# Altium schematic sheet ui_sdram.SchDoc: mcHF Pro Transceiver UI board
size A3; Author: Krassi Atanassov; CompanyName: MØNKA; Engineer: For radio amateurs experimentation, non-commercial use only. Thank you!; Revision: 0.8.5; SheetTotal: 13
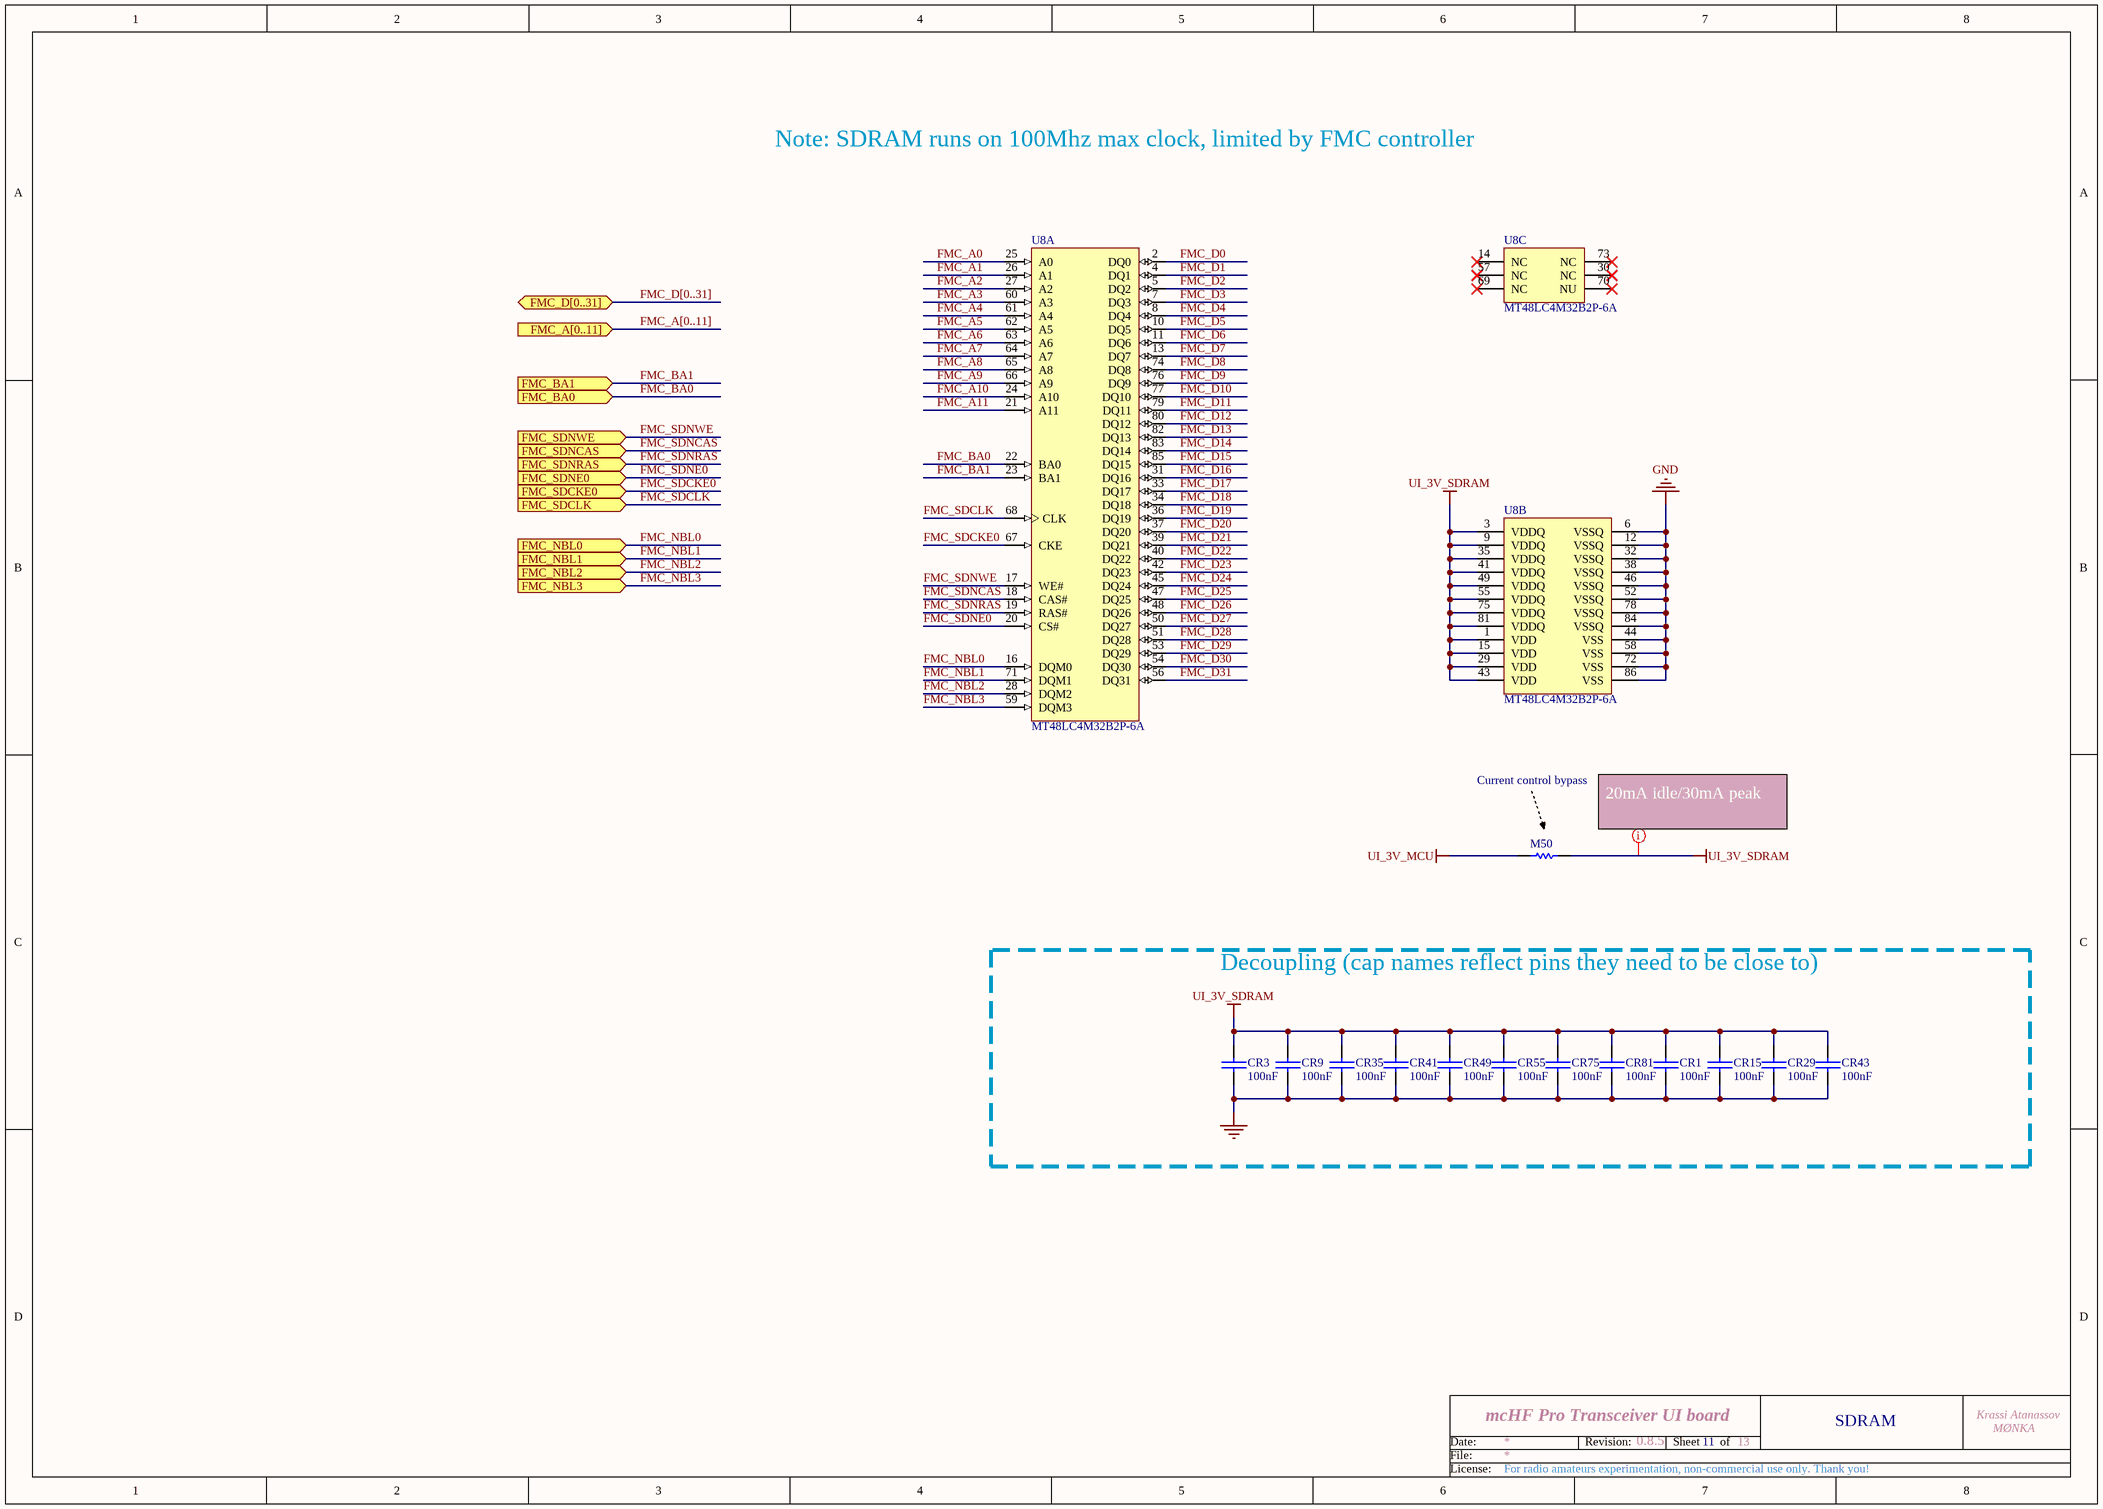
[diagram p0: ui_sdram.SchDoc]

## Parts
CR1  100nF  [0805]
CR3  100nF  [0805]
CR9  100nF  [0805]
CR15  100nF  [0805]
CR29  100nF  [0805]
CR35  100nF  [0805]
CR41  100nF  [0805]
CR43  100nF  [0805]
CR49  100nF  [0805]
CR55  100nF  [0805]
CR75  100nF  [0805]
CR81  100nF  [0805]
M50  0  [SB_0603]  (value not drawn)  (net tie, no BOM)
U8  MT48LC4M32B2P-6A  [MICT-TG-86_N]  (parts A,B,C of 3)

## Blocks framed on the sheet
Decoupling (cap names reflect pins they need to be close to): CR1 CR3 CR9 CR15 CR29 CR35 CR41 CR43 CR49 CR55 CR75 CR81

## Ports
FMC_A[0..11] (in), FMC_BA0 (in), FMC_BA1 (in), FMC_D[0..31] (bidir), FMC_NBL0 (in), FMC_NBL1 (in), FMC_NBL2 (in), FMC_NBL3 (in), FMC_SDCKE0 (in), FMC_SDCLK (in), FMC_SDNCAS (in), FMC_SDNE0 (in), FMC_SDNRAS (in), FMC_SDNWE (in)

## Nets
GND: CR1.2 CR3.2 CR9.2 CR15.2 CR29.2 CR35.2 CR41.2 CR43.2 CR49.2 CR55.2 CR75.2 CR81.2 U8.6(VSSQ) U8.12(VSSQ) U8.32(VSSQ) U8.38(VSSQ) U8.44(VSS) U8.46(VSSQ) U8.52(VSSQ) U8.58(VSS) U8.72(VSS) U8.78(VSSQ) U8.84(VSSQ) U8.86(VSS)
UI_3V_MCU: M50.1
UI_3V_SDRAM: CR1.1 CR3.1 CR9.1 CR15.1 CR29.1 CR35.1 CR41.1 CR43.1 CR49.1 CR55.1 CR75.1 CR81.1 M50.2 U8.1(VDD) U8.3(VDDQ) U8.9(VDDQ) U8.15(VDD) U8.29(VDD) U8.35(VDDQ) U8.41(VDDQ) U8.43(VDD) U8.49(VDDQ) U8.55(VDDQ) U8.75(VDDQ) U8.81(VDDQ)
FMC_A0: U8.25(A0)
FMC_A1: U8.26(A1)
FMC_A2: U8.27(A2)
FMC_A3: U8.60(A3)
FMC_A4: U8.61(A4)
FMC_A5: U8.62(A5)
FMC_A6: U8.63(A6)
FMC_A7: U8.64(A7)
FMC_A8: U8.65(A8)
FMC_A9: U8.66(A9)
FMC_A10: U8.24(A10)
FMC_A11: U8.21(A11)
FMC_BA0: U8.22(BA0) ; port FMC_BA0
FMC_BA1: U8.23(BA1) ; port FMC_BA1
FMC_D0: U8.2(DQ0)
FMC_D1: U8.4(DQ1)
FMC_D2: U8.5(DQ2)
FMC_D3: U8.7(DQ3)
FMC_D4: U8.8(DQ4)
FMC_D5: U8.10(DQ5)
FMC_D6: U8.11(DQ6)
FMC_D7: U8.13(DQ7)
FMC_D8: U8.74(DQ8)
FMC_D9: U8.76(DQ9)
FMC_D10: U8.77(DQ10)
FMC_D11: U8.79(DQ11)
FMC_D12: U8.80(DQ12)
FMC_D13: U8.82(DQ13)
FMC_D14: U8.83(DQ14)
FMC_D15: U8.85(DQ15)
FMC_D16: U8.31(DQ16)
FMC_D17: U8.33(DQ17)
FMC_D18: U8.34(DQ18)
FMC_D19: U8.36(DQ19)
FMC_D20: U8.37(DQ20)
FMC_D21: U8.39(DQ21)
FMC_D22: U8.40(DQ22)
FMC_D23: U8.42(DQ23)
FMC_D24: U8.45(DQ24)
FMC_D25: U8.47(DQ25)
FMC_D26: U8.48(DQ26)
FMC_D27: U8.50(DQ27)
FMC_D28: U8.51(DQ28)
FMC_D29: U8.53(DQ29)
FMC_D30: U8.54(DQ30)
FMC_D31: U8.56(DQ31)
FMC_NBL0: U8.16(DQM0) ; port FMC_NBL0
FMC_NBL1: U8.71(DQM1) ; port FMC_NBL1
FMC_NBL2: U8.28(DQM2) ; port FMC_NBL2
FMC_NBL3: U8.59(DQM3) ; port FMC_NBL3
FMC_SDCKE0: U8.67(CKE) ; port FMC_SDCKE0
FMC_SDCLK: U8.68(CLK) ; port FMC_SDCLK
FMC_SDNCAS: U8.18(CAS#) ; port FMC_SDNCAS
FMC_SDNE0: U8.20(CS#) ; port FMC_SDNE0
FMC_SDNRAS: U8.19(RAS#) ; port FMC_SDNRAS
FMC_SDNWE: U8.17(WE#) ; port FMC_SDNWE

Not connected (* = marked no-connect by the designer): U8 14(NC)* 30(NC)* 57(NC)* 69(NC)* 70(NU)* 73(NC)*

## Buses and harness runs
bus FMC_A[0..11] = port FMC_A[0..11]
bus FMC_D[0..31] = port FMC_D[0..31]

## Layout directives
rule Width Constraint [Pref Width = 12mil    Min Width = 12mil    Max Width = 12mil]: UI_3V_SDRAM

## Notes on the sheet
- Note: SDRAM runs on 100Mhz max clock, limited by FMC controller
- Current control bypass
- (near M50) 20mA idle/30mA peak
- 11
- SDRAM
- Date:
- File:
- Revision:
- Sheet
- of
- License:

## Library data of the parts
CR1 CR3 CR9 CR15 CR29 CR35 CR41 CR43 CR49 CR55 CR75 CR81 = CAP: Capacitor; Order: FN 282-1264; QT Order: QCC-00157; Price: 0.089
M50 = Link: Value: 1K; Published: 8-Jun-2000; Revision: July-2002: Re-released for DXP Platform.; Publisher: Altium Limited
U8 = MT48LC4M32B2P-6A: 128Mb PC133 SDR SDRAM, 4Mb x 32, 6ns, 3.3V, 0 to 70 degC, 86-Pin TSOP; Order: FN 225-3746; Price: 8.55